# EasyEDA Pro project ACS DIN Controller.eprj, schematic Top Board
Board Name: V3.0.0 Top Board; Create Date: 2026-03-01; Page Name: Main Page; Project Name: ACS DIN Controller; Schematic Name: Top Board; Update Date: 2026-03-12
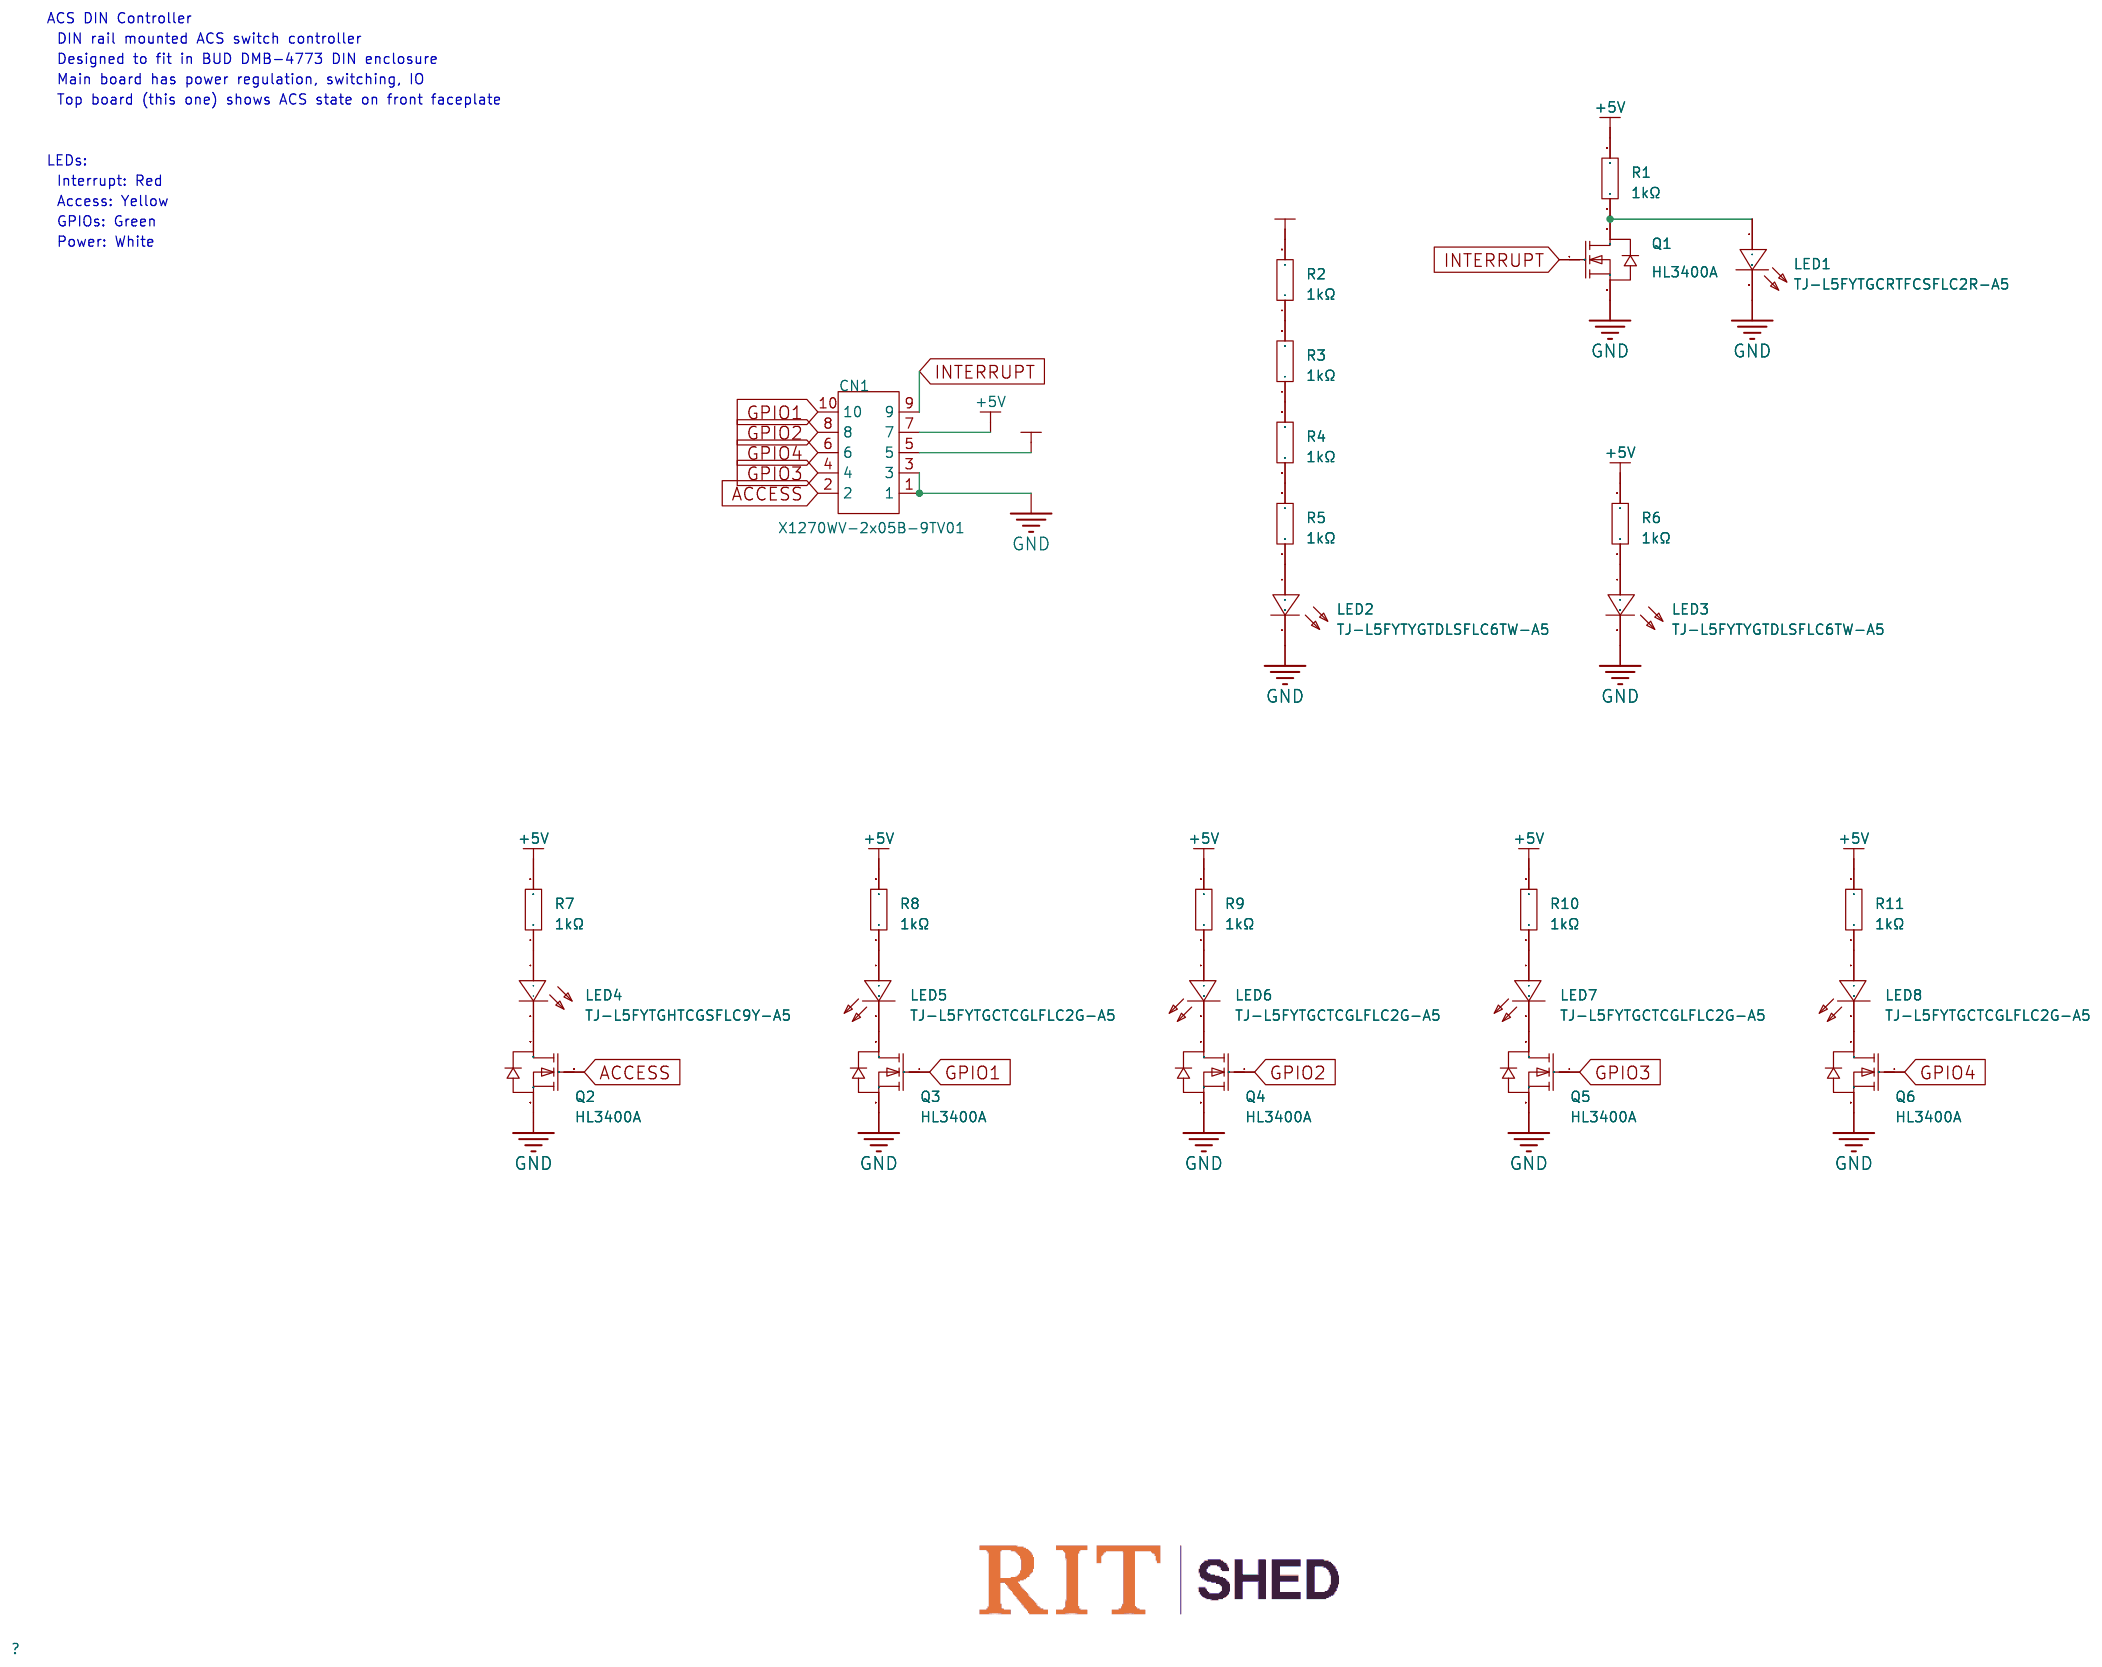
[diagram p1: schematic sheet]

## Parts
CN1  X1270WV-2x05B-9TV01  [IDC-TH_10P-P1.27-X1270WV-2X05A-6TV01]
LED1  TJ-L5FYTGCRTFCSFLC2R-A5  [LED-TH_BD5.8-P2.54-FD]
LED2  TJ-L5FYTYGTDLSFLC6TW-A5  [LED-TH_BD5.8-P2.54-FD]
LED3  TJ-L5FYTYGTDLSFLC6TW-A5  [LED-TH_BD5.8-P2.54-FD]
LED4  TJ-L5FYTGHTCGSFLC9Y-A5  [LED-TH_BD5.8-P2.54-FD]
LED5  TJ-L5FYTGCTCGLFLC2G-A5  [LED-TH_BD5.0-P2.54-FD]
LED6  TJ-L5FYTGCTCGLFLC2G-A5  [LED-TH_BD5.0-P2.54-FD]
LED7  TJ-L5FYTGCTCGLFLC2G-A5  [LED-TH_BD5.0-P2.54-FD]
LED8  TJ-L5FYTGCTCGLFLC2G-A5  [LED-TH_BD5.0-P2.54-FD]
Q1  HL3400A  [SOT-23-3_L2.9-W1.3-P1.90-LS2.4-BR]
Q2  HL3400A  [SOT-23-3_L2.9-W1.3-P1.90-LS2.4-BR]
Q3  HL3400A  [SOT-23-3_L2.9-W1.3-P1.90-LS2.4-BR]
Q4  HL3400A  [SOT-23-3_L2.9-W1.3-P1.90-LS2.4-BR]
Q5  HL3400A  [SOT-23-3_L2.9-W1.3-P1.90-LS2.4-BR]
Q6  HL3400A  [SOT-23-3_L2.9-W1.3-P1.90-LS2.4-BR]
R1  1kΩ  [R0805]
R2  1kΩ  [R0805]
R3  1kΩ  [R0805]
R4  1kΩ  [R0805]
R5  1kΩ  [R0805]
R6  1kΩ  [R0805]
R7  1kΩ  [R0805]
R8  1kΩ  [R0805]
R9  1kΩ  [R0805]
R10  1kΩ  [R0805]
R11  1kΩ  [R0805]

## Library data of the parts
CN1 = X1270WV-2x05B-9TV01: LCSC Part Name: 1.27mm 2x5P 排数:2 每排P数:5; Supplier Part: C2962225; Manufacturer: XKB Connection(中国星坤); Supplier Footprint: 插件,P=1.27mm; Datasheet: https://item.szlcsc.com/datasheet/X1270WV-2x05B-9TV01/3351701.html; Supplier: LCSC; Connector Type: IDC Header; Pitch: 1.27mm; Number of Positions or Pins: 2x5P; Current Rating: 1A; Voltage Rating (Max): 250V; Holder Type: Through Hole; Row Spacing: 1.27mm; Number of Rows: 2; Number of PINs Per Row: 5; Contact Plating: Gold; Operating Temperature: -40℃~+125℃; Color: Black
LED1 = TJ-L5FYTGCRTFCSFLC2R-A5: LCSC Part Name: 红灯; Supplier Part: C331032; Manufacturer: TOGIALED(统佳); Supplier Footprint: 插件,D=5mm; Datasheet: https://item.szlcsc.com/datasheet/TJ-L5FYTGCRTFCSFLC2R-A5/310401.html; Supplier: LCSC; Lamp Holder Type: 5mm Round Lens; Illumination Color: Red; Voltage - Forward(Vf): 1.8V~2.6V; Power(Watts): 72mW; Forward Current: 20mA; Wavelength - Dominant: 620nm~630nm; Peak Wavelength: 630nm; Lens Color: Water Clear; Luminous Intensity: 5000mcd; Viewing Angle: 30°; Operating Temperature: -20℃~+80℃
LED2 LED3 = TJ-L5FYTYGTDLSFLC6TW-A5: LCSC Part Name: 白灯; Supplier Part: C330768; Manufacturer: TOGIALED(统佳); Supplier Footprint: 插件,D=5mm; JLCPCB Part Class: Extended Part; Datasheet: https://item.szlcsc.com/datasheet/TJ-L5FYTYGTDLSFLC6TW-A5/310381.html; Supplier: LCSC; Lamp Holder Type: 5mm Round Lens; Illumination Color: White; Forward Current: 20mA; Lens Color: Water Clear; Viewing Angle: 30°; Operating Temperature: -20℃~+80℃
LED4 = TJ-L5FYTGHTCGSFLC9Y-A5: LCSC Part Name: 黄灯; Supplier Part: C440407; Manufacturer: TOGIALED(统佳); Supplier Footprint: 插件,D=5mm; Datasheet: https://item.szlcsc.com/datasheet/TJ-L5FYTGHTCGSFLC9Y-A5/439856.html; Supplier: LCSC; Lamp Holder Type: 5mm Round Lens; Illumination Color: Yellow; Power(Watts): 72mW; Forward Current: 20mA; Wavelength - Dominant: 585nm~595nm; Peak Wavelength: 591nm; Lens Color: Water Clear; Viewing Angle: 30°; Operating Temperature: -20℃~+80℃
LED5-LED8 = TJ-L5FYTGCTCGLFLC2G-A5: LCSC Part Name: 翠绿; Supplier Part: C330743; Manufacturer: TOGIALED(统佳); Supplier Footprint: 插件,D=5mm; JLCPCB Part Class: Extended Part; Datasheet: https://item.szlcsc.com/datasheet/TJ-L5FYTGCTCGLFLC2G-A5/310356.html; Supplier: LCSC; Lamp Holder Type: 5mm Round Lens; Illumination Color: Emerald Green; Voltage - Forward(Vf): 2.8V~3.6V; Power(Watts): 108mW; Forward Current: 20mA; Wavelength - Dominant: 515nm~530nm; Peak Wavelength: 518nm; Lens Color: Water Clear; Luminous Intensity: 35000mcd; Viewing Angle: 30°; Operating Temperature: -20℃~+80℃
Q1-Q6 = HL3400A: LCSC Part Name: 1个N沟道 耐压:30V 电流:5.8A; Supplier Part: C7420348; Manufacturer: R+O(宏嘉诚); Supplier Footprint: SOT-23; Datasheet: https://item.szlcsc.com/datasheet/HL3400A/8397170.html; Supplier: LCSC; Number: One N-channel; Drain to Source Voltage: 30V; Current - Continuous Drain(Id): 5.8A; RDS(on): 35mΩ@10V; Pd - Power Dissipation: 350mW; Gate Threshold Voltage (Vgs(th)): 1.4V@250uA; Input Capacitance(Ciss): 1.05nF; Reverse Transfer Capacitance (Crss@Vds): 77pF; Operating Temperature: -55℃~+150℃; Type: N-Channel; Output Capacitance(Coss): 99pF
R1-R11 = 0805W8F1001T5E: LCSC Part Name: 1kΩ ±1% 125mW 厚膜电阻; Supplier Part: C17513; Manufacturer: UNI-ROYAL(厚声); Supplier Footprint: 0805; Datasheet: https://atta.szlcsc.com/upload/public/pdf/source/20200306/C422600_1E6D84923E4A46A82E41ADD87F860B5C.pdf; Supplier: LCSC; Type: Thick Film Resistors; Tolerance: ±1%; Temperature Coefficient: ±100ppm/℃; Operating Temperature Range: -55℃~+155℃

## Nets
+5V: CN1.7 R1.2 R6.2 R7.2 R8.2 R9.2 R10.2 R11.2
+12V: CN1.5 R2.2
GND: CN1.1 CN1.3 LED1.2(C) LED2.2 LED3.2 Q1.2(S) Q2.2(S) Q3.2(S) Q4.2(S) Q5.2(S) Q6.2(S)
ACCESS: CN1.2 Q2.1(G)
GPIO1: CN1.10 Q3.1(G)
GPIO2: CN1.8 Q4.1(G)
GPIO3: CN1.4 Q5.1(G)
GPIO4: CN1.6 Q6.1(G)
INTERRUPT: CN1.9 Q1.1(G)
$1N995: LED1.1(A) Q1.3(D) R1.1
$1N1232: LED3.1 R6.1
$1N1271: LED2.1 R5.1
$1N1349: R4.1 R5.2
$1N1388: R3.1 R4.2
$1N1427: R2.1 R3.2
$1N1573: LED4.1(+) R7.1
$1N1719: LED4.2(-) Q2.3(D)
$1N1899: LED5.1(A) R8.1
$1N1901: LED5.2(C) Q3.3(D)
$1N2053: LED6.2(C) Q4.3(D)
$1N2055: LED6.1(A) R9.1
$1N2211: LED7.2(C) Q5.3(D)
$1N2213: LED7.1(A) R10.1
$1N2369: LED8.2(C) Q6.3(D)
$1N2371: LED8.1(A) R11.1

## Notes on the sheet
- ACS DIN Controller
- DIN rail mounted ACS switch controller
- Designed to fit in BUD DMB-4773 DIN enclosure
- Main board has power regulation, switching, IO
- Top board (this one) shows ACS state on front faceplate
- LEDs:
- Interrupt: Red
- Access: Yellow
- GPIOs: Green
- Power: White
